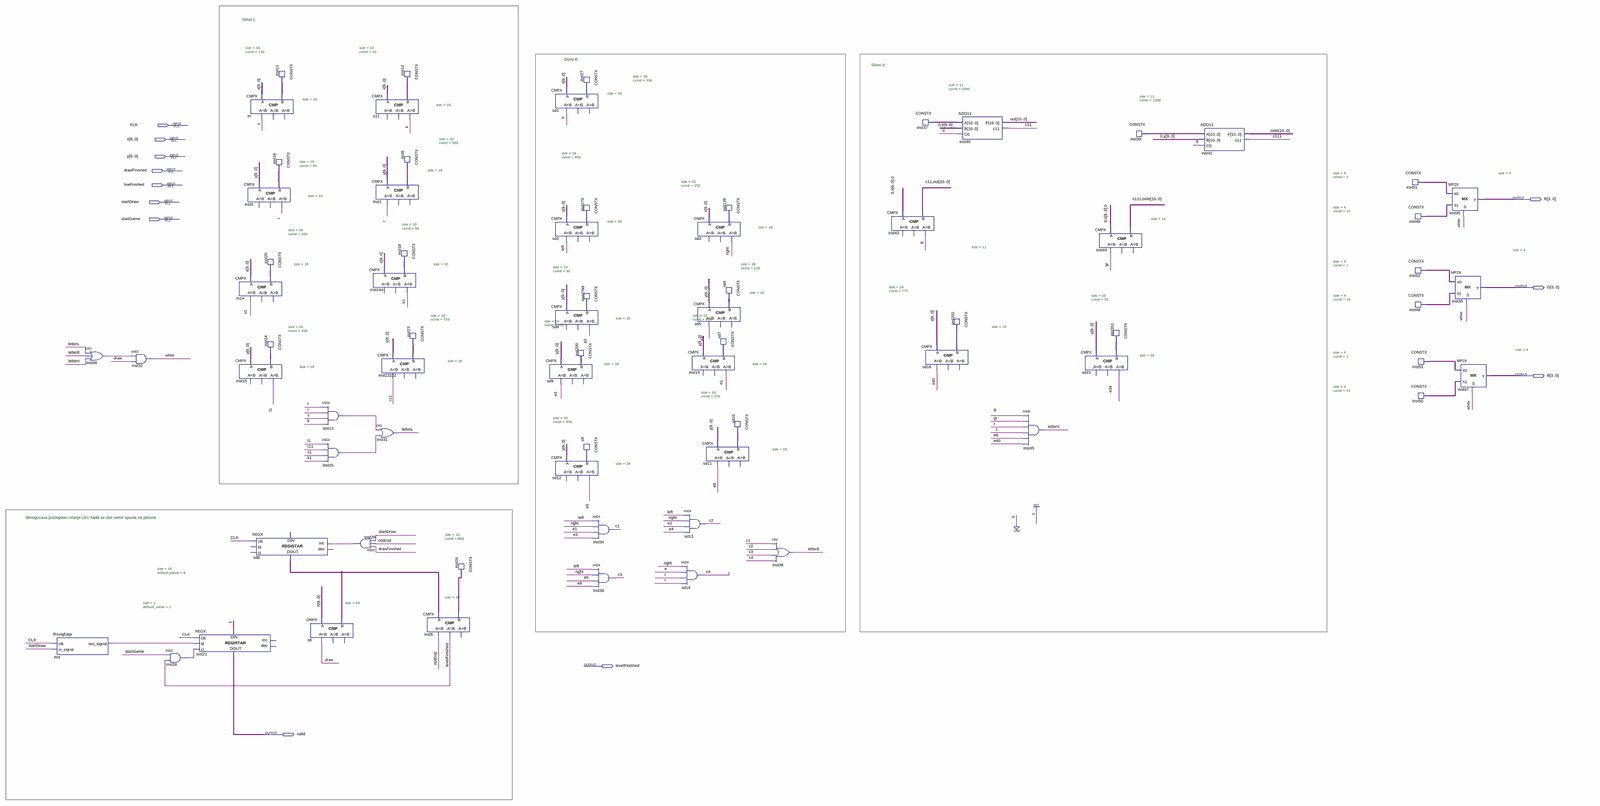
[diagram p0: schematic sheet, whole]
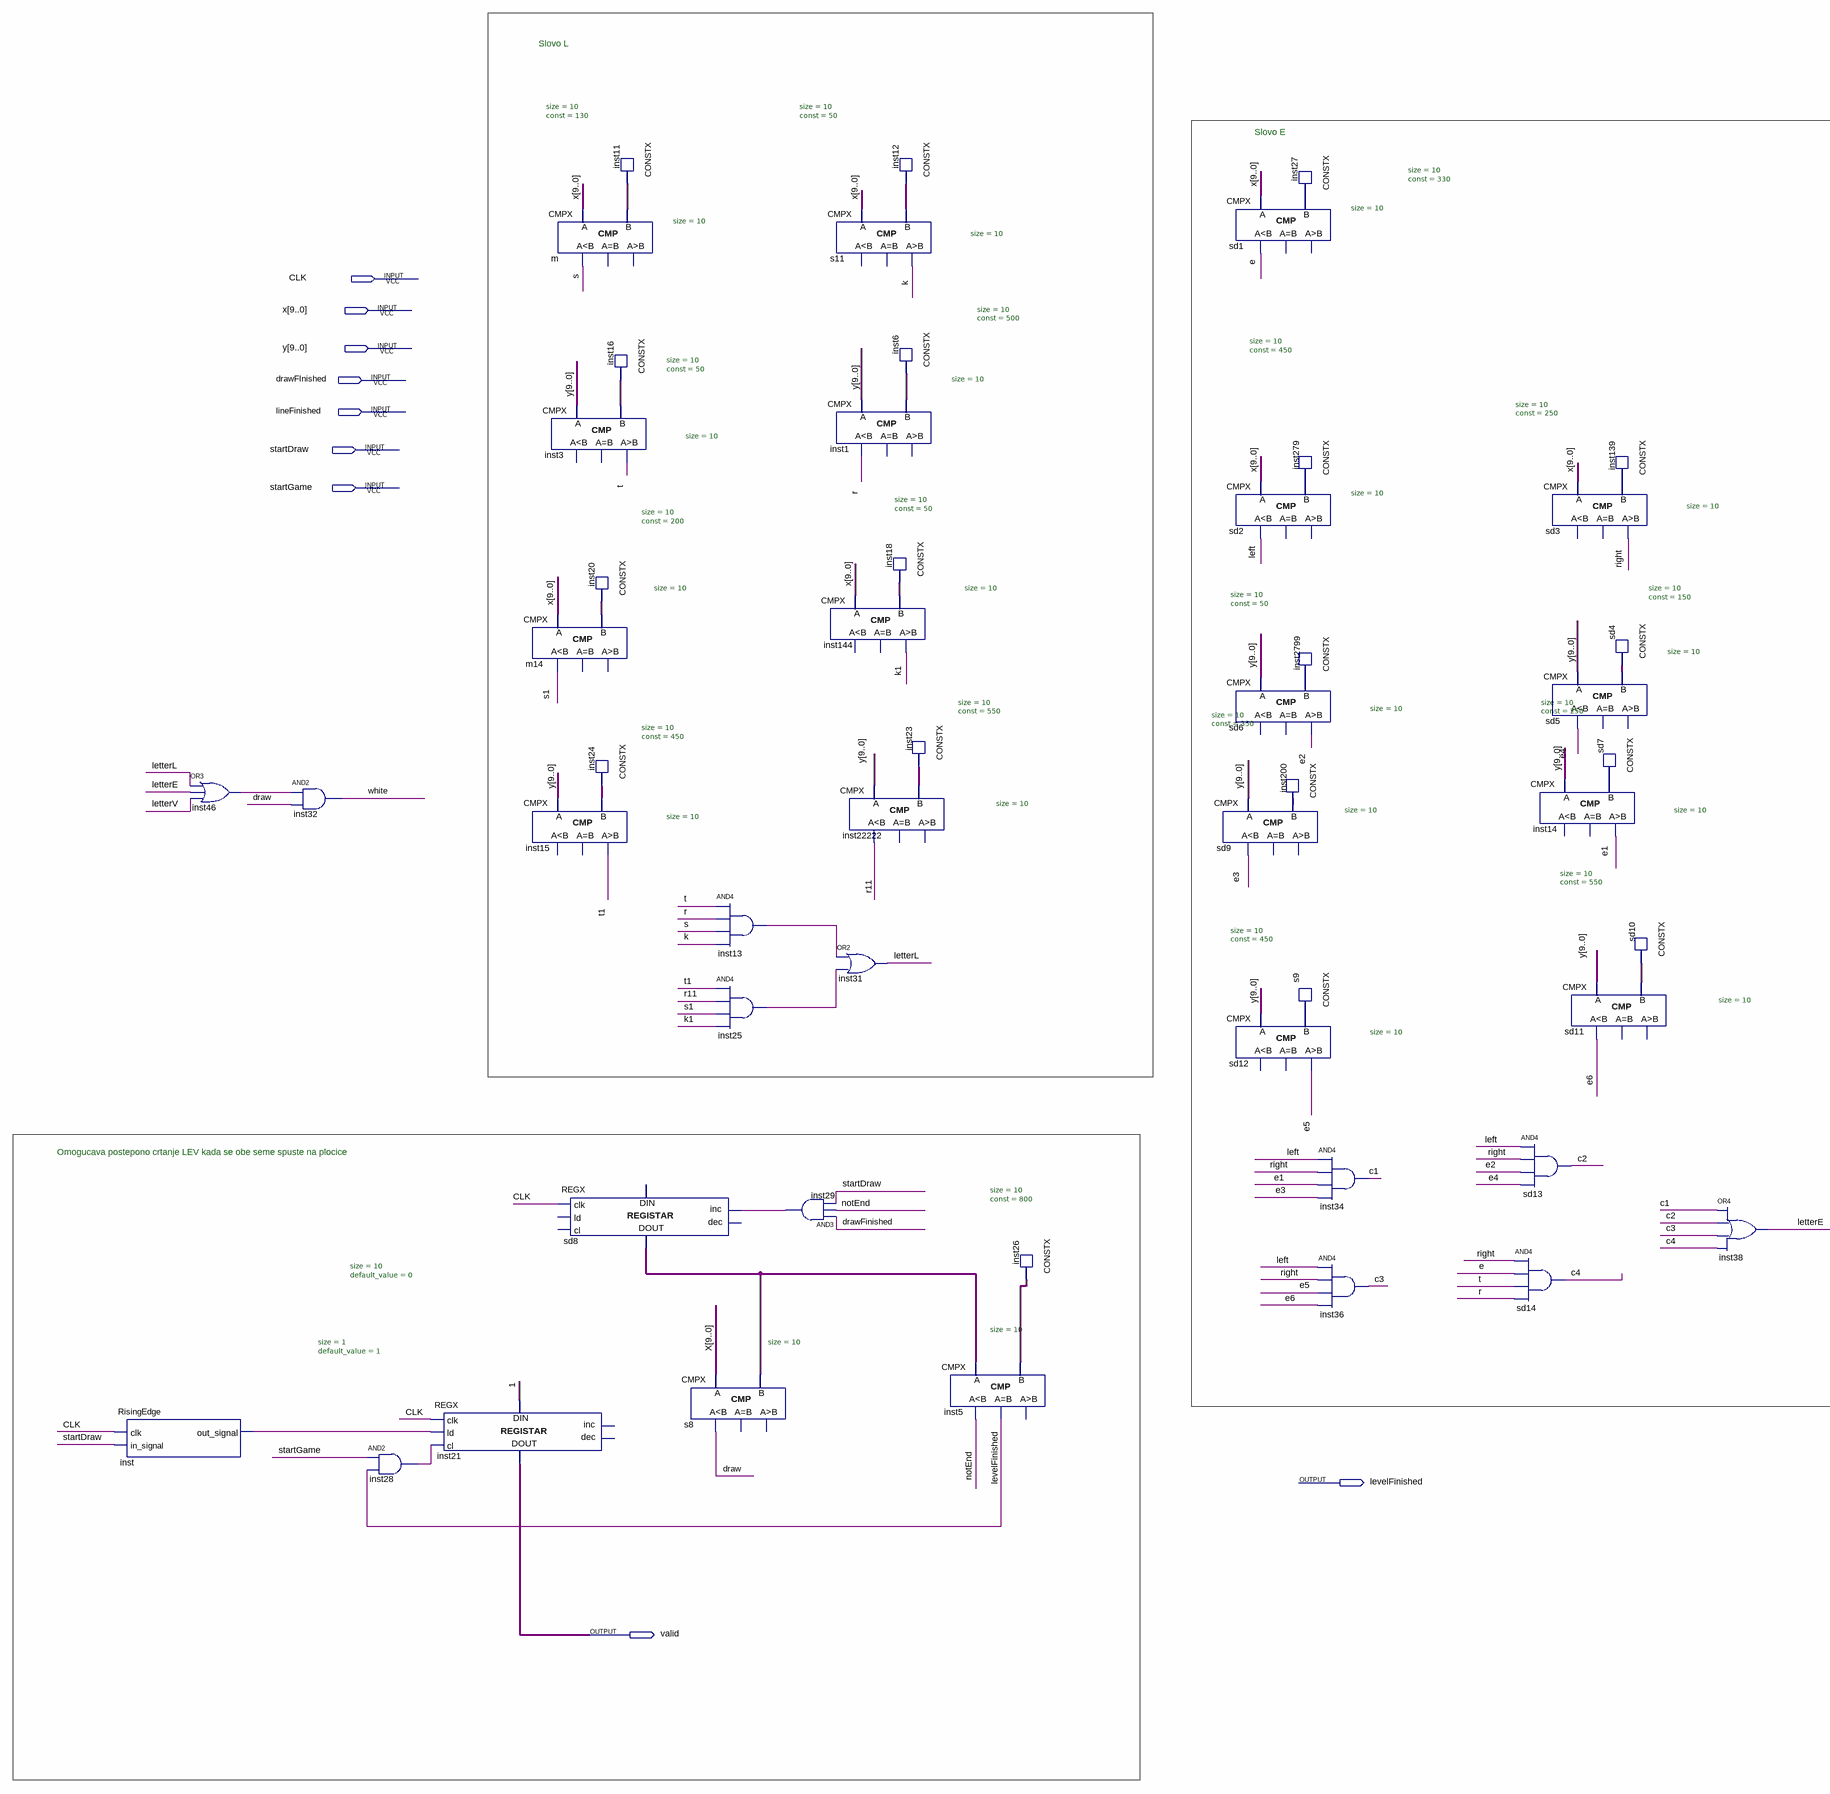
[diagram p1: schematic sheet, left part]
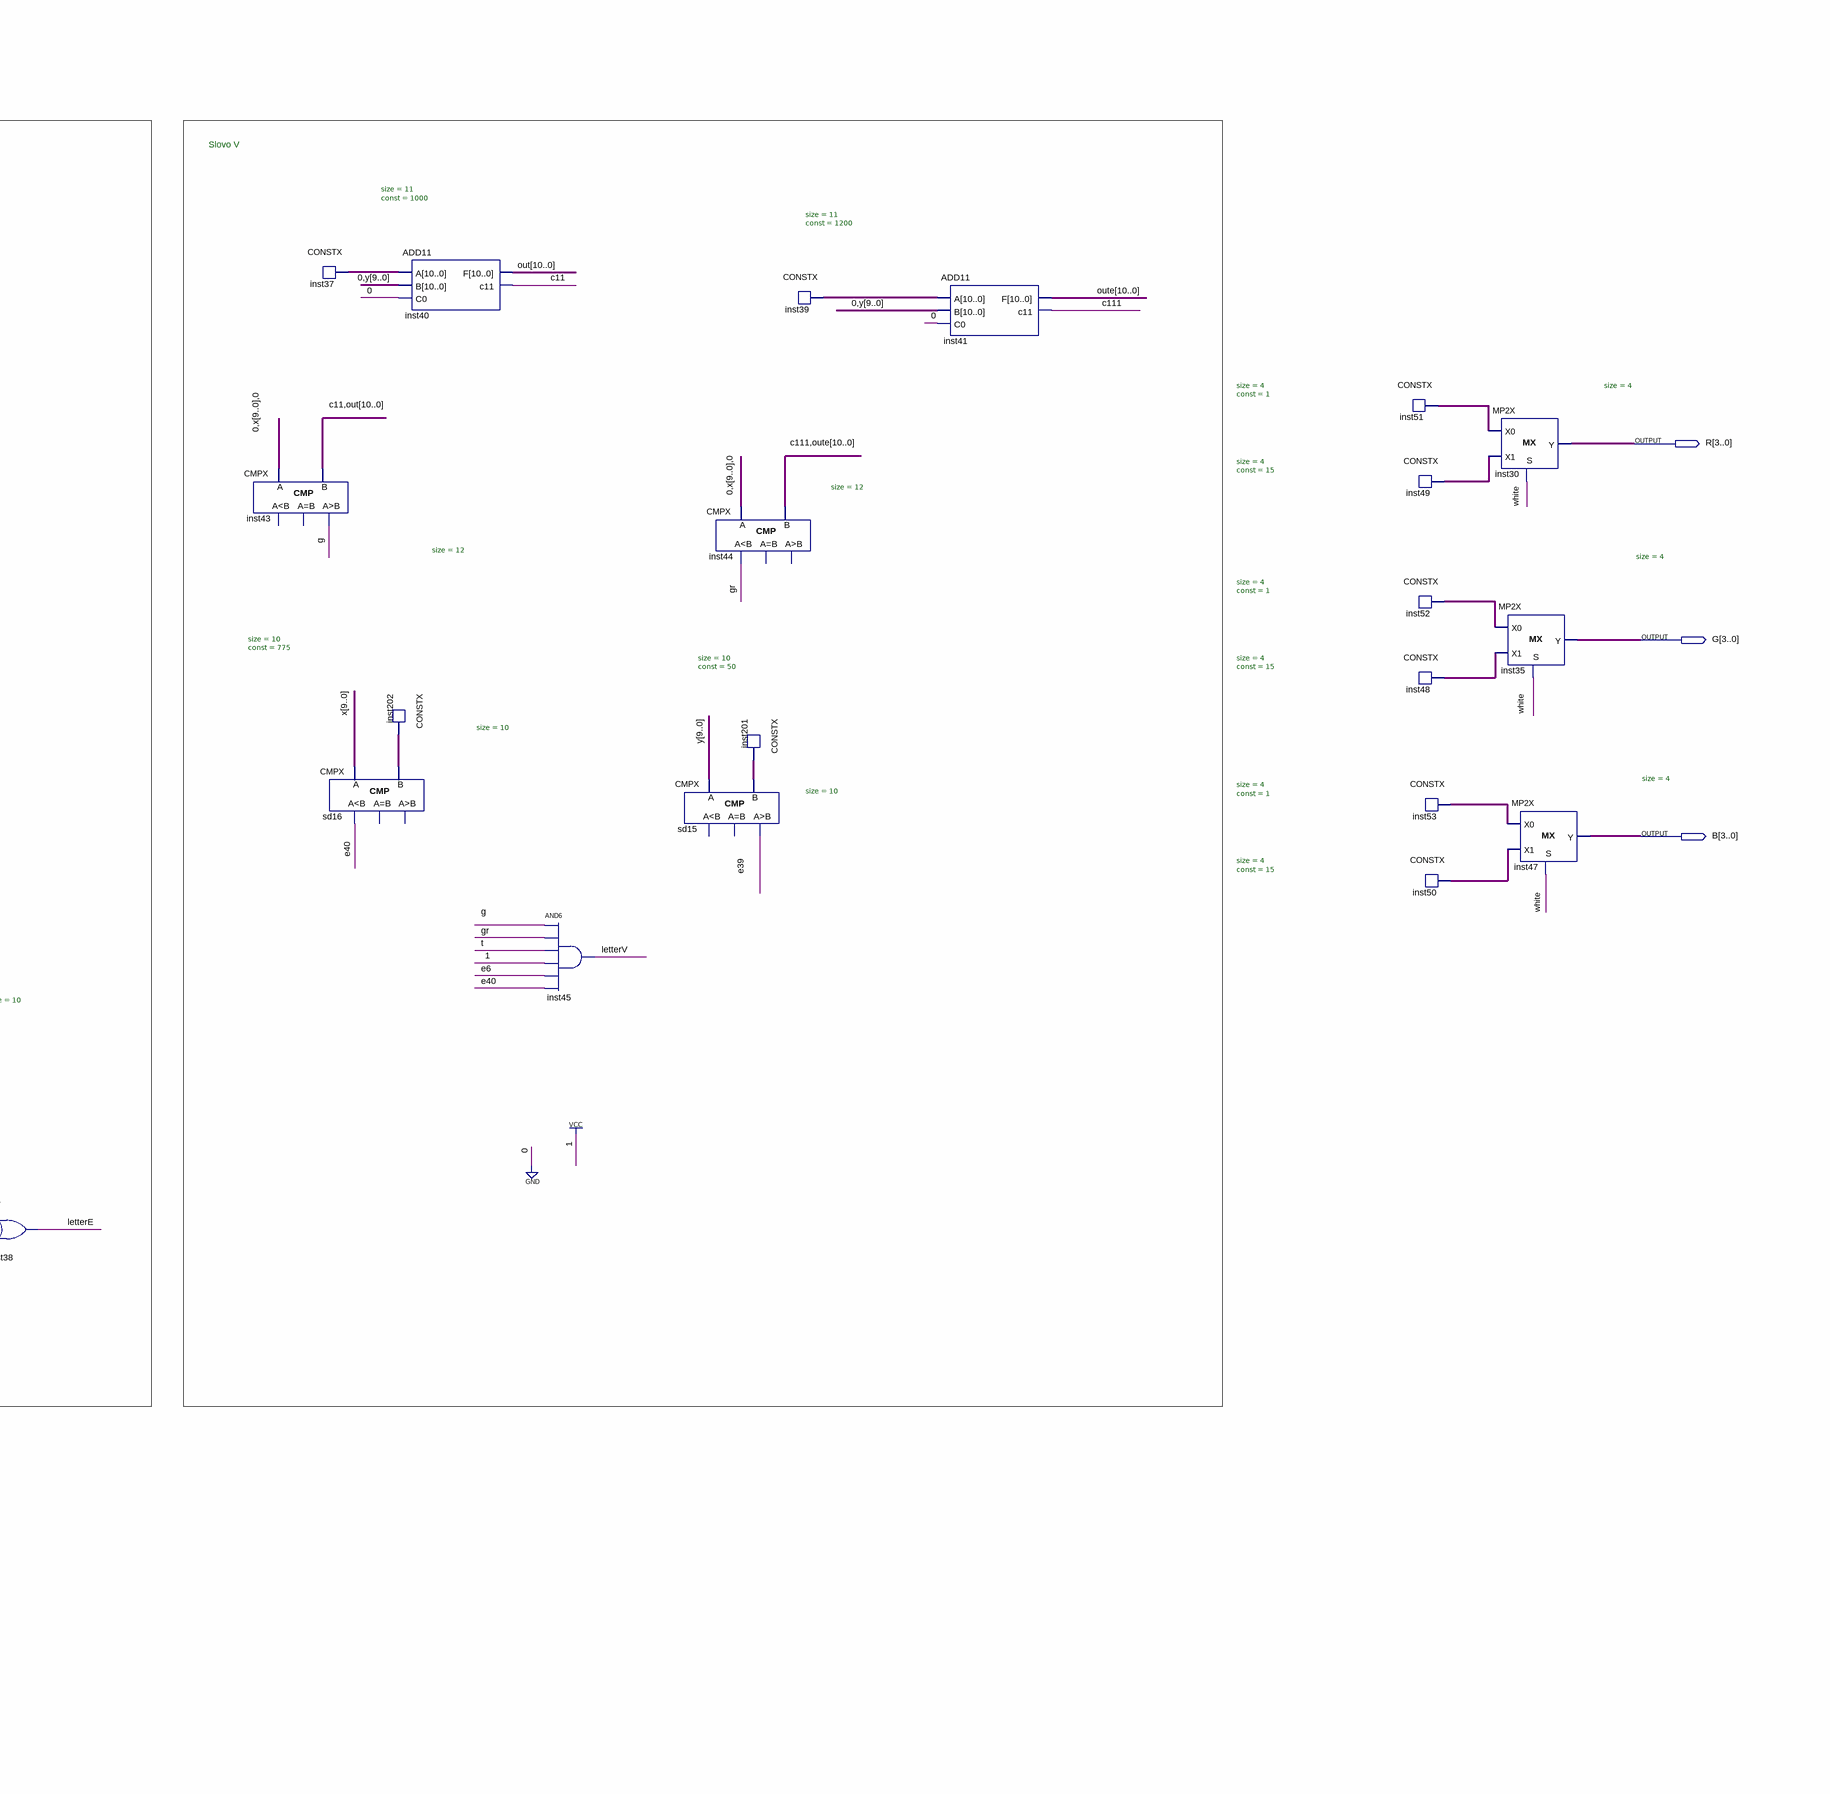
[diagram p2: schematic sheet, right part]
// Quartus schematic LEV.bdf as structural Verilog: 72 symbols, 12 pins
module LEV (
  input  CLK,
  input  [9:0] x,
  input  [9:0] y,
  input  drawFInished,
  input  lineFinished,
  input  startDraw,
  input  startGame,
  output [3:0] R,
  output [3:0] G,
  output [3:0] B,
  output levelFinished,
  output valid
);

  wire c1, c2, c3, c4, c11, c111, draw, e, e1, e2, e3, e4, e5, e6, e39, e40, G_1bit, gr, inst13_out,
       inst25_out, inst28_out, inst29_out, inst46_out, inst_out_signal, k, k1, left, letterE, letterL,
       letterV, notEnd, r11, R_1bit, right, s, s1, t, t1, white;
  wire [3:0] inst48_data, inst49_data, inst50_data, inst51_data, inst52_data, inst53_data;
  wire [9:0] inst6_data, inst11_data, inst12_data, inst16_data, inst18_data, inst20_data, inst23_data,
       inst24_data, inst26_data, inst27_data, inst139_data, inst200_data, inst201_data, inst202_data,
       inst279_data, inst2799_data, s9_data, sd4_data, sd7_data, sd8_data_out, sd10_data;
  wire [10:0] inst37_data, inst39_data, out, oute;

  RisingEdge inst (.clk(CLK), .in_signal(startDraw), .out_signal(inst_out_signal));
  or inst46 (inst46_out, letterL, letterE, letterV);
  and inst32 (white, inst46_out, draw);
  and inst28 (inst28_out, startGame, levelFinished);
  REGX #(.size(1), .default_value(1)) inst21 (
    .clk(CLK), .ld(inst_out_signal), .cl(inst28_out), .data_in(1'b1), .data_out(valid));  // open: inc, dec
  CMPX #(.size(10)) m14 (.A(x), .B(inst20_data), .ls(s1));  // open: eq, gr
  CMPX #(.size(10)) inst15 (.A(y), .B(inst24_data), .gr(t1));  // open: ls, eq
  CMPX #(.size(10)) m (.A(x), .B(inst11_data), .ls(s));  // open: eq, gr
  CMPX #(.size(10)) inst3 (.A(y), .B(inst16_data), .gr(t));  // open: ls, eq
  REGX #(.size(10), .default_value(0)) sd8 (
    .clk(CLK), .inc(inst29_out), .data_out(sd8_data_out));  // open: ld, cl, dec, data_in
  CONSTX #(.size(10), .\const (130)) inst11 (.data(inst11_data));
  CONSTX #(.size(10), .\const (50)) inst16 (.data(inst16_data));
  CONSTX #(.size(10), .\const (200)) inst20 (.data(inst20_data));
  CONSTX #(.size(10), .\const (450)) inst24 (.data(inst24_data));
  CMPX #(.size(10)) s8 (.A(x), .B(sd8_data_out), .ls(draw));  // open: eq, gr
  and inst13 (inst13_out, t, R_1bit, s, k);
  and inst25 (inst25_out, t1, r11, s1, k1);
  CMPX #(.size(10)) s11 (.A(x), .B(inst12_data), .gr(k));  // open: ls, eq
  CMPX #(.size(10)) inst1 (.A(y), .B(inst6_data), .ls(R_1bit));  // open: eq, gr
  CMPX #(.size(10)) inst144 (.A(x), .B(inst18_data), .gr(k1));  // open: ls, eq
  and inst29 (inst29_out, drawFInished, notEnd, startDraw);
  CONSTX #(.size(10), .\const (50)) inst18 (.data(inst18_data));
  CMPX #(.size(10)) inst22222 (.A(y), .B(inst23_data), .ls(r11));  // open: eq, gr
  or inst31 (letterL, inst13_out, inst25_out);
  CONSTX #(.size(10), .\const (50)) inst12 (.data(inst12_data));
  CONSTX #(.size(10), .\const (500)) inst6 (.data(inst6_data));
  CONSTX #(.size(10), .\const (550)) inst23 (.data(inst23_data));
  CMPX #(.size(10)) inst5 (.A(sd8_data_out), .B(inst26_data), .ls(notEnd), .eq(levelFinished));  // open: gr
  CONSTX #(.size(10), .\const (800)) inst26 (.data(inst26_data));
  CMPX #(.size(10)) sd1 (.A(x), .B(inst27_data), .ls(e));  // open: eq, gr
  CMPX #(.size(10)) sd2 (.A(x), .B(inst279_data), .ls(left));  // open: eq, gr
  CMPX #(.size(10)) sd6 (.A(y), .B(inst2799_data), .gr(e2));  // open: ls, eq
  CMPX #(.size(10)) sd9 (.A(y), .B(inst200_data), .ls(e3));  // open: eq, gr
  CMPX #(.size(10)) sd12 (.A(y), .B(s9_data), .gr(e5));  // open: ls, eq
  CONSTX #(.size(10), .\const (330)) inst27 (.data(inst27_data));
  CONSTX #(.size(10), .\const (450)) inst279 (.data(inst279_data));
  CONSTX #(.size(10), .\const (50)) inst2799 (.data(inst2799_data));
  CONSTX #(.size(10), .\const (350)) inst200 (.data(inst200_data));
  CONSTX #(.size(10), .\const (450)) s9 (.data(s9_data));
  and inst34 (c1, left, right, e1, e3);
  and inst36 (c3, left, right, e5, e6);
  CMPX #(.size(10)) sd3 (.A(x), .B(inst139_data), .gr(right));  // open: ls, eq
  CMPX #(.size(10)) sd5 (.A(y), .B(sd4_data), .ls(e4));  // open: eq, gr
  CMPX #(.size(10)) inst14 (.A(y), .B(sd7_data), .gr(e1));  // open: ls, eq
  and sd13 (c2, left, right, e2, e4);
  and sd14 (c4, right, e, t, R_1bit);
  CONSTX #(.size(10), .\const (250)) sd7 (.data(sd7_data));
  CMPX #(.size(10)) sd11 (.A(y), .B(sd10_data), .ls(e6));  // open: eq, gr
  CONSTX #(.size(10), .\const (250)) inst139 (.data(inst139_data));
  CONSTX #(.size(10), .\const (150)) sd4 (.data(sd4_data));
  CONSTX #(.size(10), .\const (550)) sd10 (.data(sd10_data));
  or inst38 (letterE, c1, c2, c3, c4);
  CMPX #(.size(12)) inst43 (.A({1'b0, x, 1'b0}), .B({c11, out}), .gr(G_1bit));  // open: ls, eq
  CONSTX #(.size(11), .\const (1000)) inst37 (.data(inst37_data));
  CMPX #(.size(10)) sd16 (.A(x), .B(inst202_data), .ls(e40));  // open: eq, gr
  ADD11 inst40 (.A(inst37_data), .B({1'b0, y}), .C0(1'b0), .F(out), .c11(c11));
  CONSTX #(.size(10), .\const (775)) inst202 (.data(inst202_data));
  and inst45 (letterV, G_1bit, gr, t, 1'b1, e6, e40);
  CMPX #(.size(10)) sd15 (.A(y), .B(inst201_data), .gr(e39));  // open: ls, eq
  CMPX #(.size(12)) inst44 (.A({1'b0, x, 1'b0}), .B({c111, oute}), .ls(gr));  // open: eq, gr
  CONSTX #(.size(10), .\const (50)) inst201 (.data(inst201_data));
  CONSTX #(.size(11), .\const (1200)) inst39 (.data(inst39_data));
  ADD11 inst41 (.A(inst39_data), .B({1'b0, y}), .C0(1'b0), .F(oute), .c11(c111));
  CONSTX #(.size(4), .\const (1)) inst51 (.data(inst51_data));
  CONSTX #(.size(4), .\const (15)) inst49 (.data(inst49_data));
  CONSTX #(.size(4), .\const (1)) inst52 (.data(inst52_data));
  CONSTX #(.size(4), .\const (15)) inst48 (.data(inst48_data));
  CONSTX #(.size(4), .\const (1)) inst53 (.data(inst53_data));
  CONSTX #(.size(4), .\const (15)) inst50 (.data(inst50_data));
  MP2X #(.size(4)) inst30 (.S(white), .X0(inst51_data), .X1(inst49_data), .Y(R));
  MP2X #(.size(4)) inst35 (.S(white), .X0(inst52_data), .X1(inst48_data), .Y(G));
  MP2X #(.size(4)) inst47 (.S(white), .X0(inst53_data), .X1(inst50_data), .Y(B));

  // Notes on the sheet:
  //   Slovo L
  //   Slovo E
  //   Slovo V
  //   Omogucava postepono crtanje LEV kada se obe seme spuste na plocice          
endmodule
